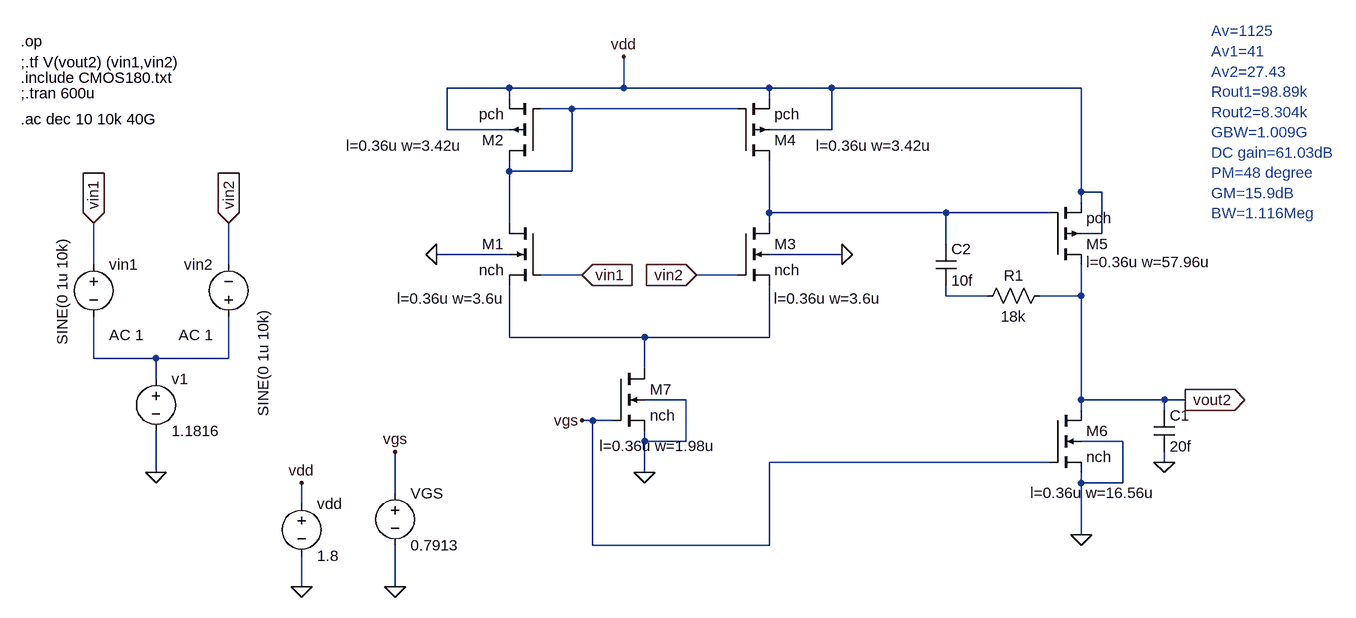
[diagram p0: schematic DOUBLE STAGE OPAMP.asc]
DOUBLE STAGE OPAMP.asc, the LTspice schematic file:
Version 4
SHEET 1 1128 680
WIRE -160 -224 -256 -224
WIRE 16 -224 16 -272
WIRE 16 -224 -160 -224
WIRE 240 -224 16 -224
WIRE 336 -224 240 -224
WIRE 720 -224 336 -224
WIRE -160 -208 -160 -224
WIRE 240 -208 240 -224
WIRE -64 -192 -112 -192
WIRE 192 -192 -64 -192
WIRE -256 -160 -256 -224
WIRE -160 -160 -256 -160
WIRE 336 -160 336 -224
WIRE 336 -160 240 -160
WIRE -160 -96 -160 -112
WIRE -64 -96 -64 -192
WIRE -64 -96 -160 -96
WIRE 720 -64 720 -224
WIRE 752 -64 720 -64
WIRE 720 -48 720 -64
WIRE 240 -32 240 -112
WIRE 512 -32 240 -32
WIRE 672 -32 512 -32
WIRE -160 -16 -160 -96
WIRE 240 -16 240 -32
WIRE 752 0 752 -64
WIRE 752 0 720 0
WIRE 512 16 512 -32
WIRE -160 32 -272 32
WIRE 352 32 240 32
WIRE -800 48 -800 -16
WIRE -592 48 -592 -16
WIRE -48 64 -112 64
WIRE 192 64 128 64
WIRE 512 96 512 80
WIRE 576 96 512 96
WIRE 720 96 720 48
WIRE 720 96 656 96
WIRE -160 160 -160 80
WIRE 48 160 -160 160
WIRE 240 160 240 80
WIRE 240 160 48 160
WIRE -800 192 -800 128
WIRE -704 192 -800 192
WIRE -592 192 -592 128
WIRE -592 192 -704 192
WIRE 48 208 48 160
WIRE -704 224 -704 192
WIRE 112 256 48 256
WIRE 720 256 720 96
WIRE 848 256 720 256
WIRE 880 256 848 256
WIRE 720 272 720 256
WIRE 848 272 848 256
WIRE -32 288 -48 288
WIRE 0 288 -32 288
WIRE 48 320 48 304
WIRE 112 320 112 256
WIRE 112 320 48 320
WIRE 784 320 720 320
WIRE 672 352 240 352
WIRE 848 352 848 336
WIRE -704 368 -704 304
WIRE 48 368 48 320
WIRE 720 384 720 368
WIRE 784 384 784 320
WIRE 784 384 720 384
WIRE -336 400 -336 336
WIRE -480 416 -480 384
WIRE 720 464 720 384
WIRE -32 480 -32 288
WIRE 240 480 240 352
WIRE 240 480 -32 480
WIRE -480 544 -480 496
WIRE -336 544 -336 480
FLAG 16 -272 vdd
FLAG 48 368 0
FLAG -704 368 0
FLAG -800 -16 vin1
IOPIN -800 -16 In
FLAG -592 -16 vin2
IOPIN -592 -16 In
FLAG -48 64 vin1
IOPIN -48 64 In
FLAG 128 64 vin2
IOPIN 128 64 In
FLAG -480 384 vdd
FLAG -480 544 0
FLAG -272 32 0
FLAG 352 32 0
FLAG 880 256 vout2
IOPIN 880 256 Out
FLAG 720 464 0
FLAG 848 352 0
FLAG -48 288 vgs
FLAG -336 544 0
FLAG -336 336 vgs
SYMBOL nmos4 -112 -16 M0
WINDOW 123 55 116 Left 2
SYMATTR Value2 l=0.36u w=3.6u
SYMATTR InstName M1
SYMATTR Value nch
SYMBOL pmos4 -112 -112 R180
WINDOW 123 120 23 Left 2
SYMATTR Value2 l=0.36u w=3.42u
SYMATTR InstName M2
SYMATTR Value pch
SYMBOL nmos4 192 -16 R0
WINDOW 123 55 116 Left 2
SYMATTR Value2 l=0.36u w=3.6u
SYMATTR InstName M3
SYMATTR Value nch
SYMBOL pmos4 192 -112 M180
WINDOW 123 120 23 Left 2
SYMATTR Value2 l=0.36u w=3.42u
SYMATTR InstName M4
SYMATTR Value pch
SYMBOL voltage -704 208 R0
WINDOW 123 0 0 Left 0
WINDOW 39 0 0 Left 0
SYMATTR InstName v1
SYMATTR Value 1.1816
SYMBOL voltage -800 32 R0
WINDOW 3 -48 -25 VRight 2
WINDOW 123 24 124 Left 2
WINDOW 39 0 0 Left 0
SYMATTR Value SINE(0 1u 10k)
SYMATTR Value2 AC 1
SYMATTR InstName vin1
SYMBOL voltage -592 144 R180
WINDOW 0 24 96 Left 2
WINDOW 3 -53 -138 VRight 2
WINDOW 123 24 -12 Left 2
WINDOW 39 0 0 Left 0
SYMATTR InstName vin2
SYMATTR Value SINE(0 1u 10k)
SYMATTR Value2 AC 1
SYMBOL voltage -480 400 R0
WINDOW 123 0 0 Left 0
WINDOW 39 0 0 Left 0
SYMATTR InstName vdd
SYMATTR Value 1.8
SYMBOL pmos4 672 48 M180
WINDOW 123 56 4 Left 2
SYMATTR Value2 l=0.36u w=57.96u
SYMATTR InstName M5
SYMATTR Value pch
SYMBOL nmos4 672 272 R0
WINDOW 123 -30 127 Left 2
SYMATTR Value2 l=0.36u w=16.56u
SYMATTR InstName M6
SYMATTR Value nch
SYMBOL cap 832 272 R0
SYMATTR InstName C1
SYMATTR Value 20f
SYMBOL nmos4 0 208 R0
WINDOW 123 -21 119 Left 2
SYMATTR Value2 l=0.36u w=1.98u
SYMATTR InstName M7
SYMATTR Value nch
SYMBOL res 672 80 R90
WINDOW 0 0 56 VBottom 2
WINDOW 3 32 56 VTop 2
SYMATTR InstName R1
SYMATTR Value 18k
SYMBOL cap 496 16 R0
SYMATTR InstName C2
SYMATTR Value 10f
SYMBOL voltage -336 384 R0
WINDOW 123 0 0 Left 0
WINDOW 39 0 0 Left 0
SYMATTR InstName VGS
SYMATTR Value 0.7913
TEXT -912 -240 Left 2 !.include CMOS180.txt
TEXT -912 -296 Left 2 !.op
TEXT -912 -264 Left 2 !;.tf V(vout2) (vin1,vin2)
TEXT -912 -216 Left 2 !;.tran 600u
TEXT -912 -176 Left 2 !.ac dec 10 10k 40G
TEXT 920 -312 Left 2 ;Av=1125\nAv1=41\nAv2=27.43\nRout1=98.89k\nRout2=8.304k\nGBW=1.009G\nDC gain=61.03dB\nPM=48 degree\nGM=15.9dB\nBW=1.116Meg

The netlist it stands for:
* DOUBLE STAGE OPAMP.asc
M1 N001 vin1 N004 0 nch l=0.36u w=3.6u
M2 N001 N001 vdd vdd pch l=0.36u w=3.42u
M3 N002 vin2 N004 0 nch l=0.36u w=3.6u
M4 N002 N001 vdd vdd pch l=0.36u w=3.42u
v1 N005 0 1.1816
vin1 vin1 N005 SINE(0 1u 10k) AC 1
vin2 N005 vin2 SINE(0 1u 10k) AC 1
vdd vdd 0 1.8
M5 vout2 N002 vdd vdd pch l=0.36u w=57.96u
M6 vout2 vgs 0 0 nch l=0.36u w=16.56u
C1 vout2 0 20f
M7 N004 vgs 0 0 nch l=0.36u w=1.98u
R1 vout2 N003 18k
C2 N002 N003 10f
VGS vgs 0 0.7913
.model NMOS NMOS
.model PMOS PMOS
.lib standard.mos
.include CMOS180.txt
.op
;.tf V(vout2) (vin1,vin2)
;.tran 600u
.ac dec 10 10k 40G
* Av=1125
* Av1=41
* Av2=27.43
* Rout1=98.89k
* Rout2=8.304k
* GBW=1.009G
* DC gain=61.03dB
* PM=48 degree
* GM=15.9dB
* BW=1.116Meg
.backanno
.end